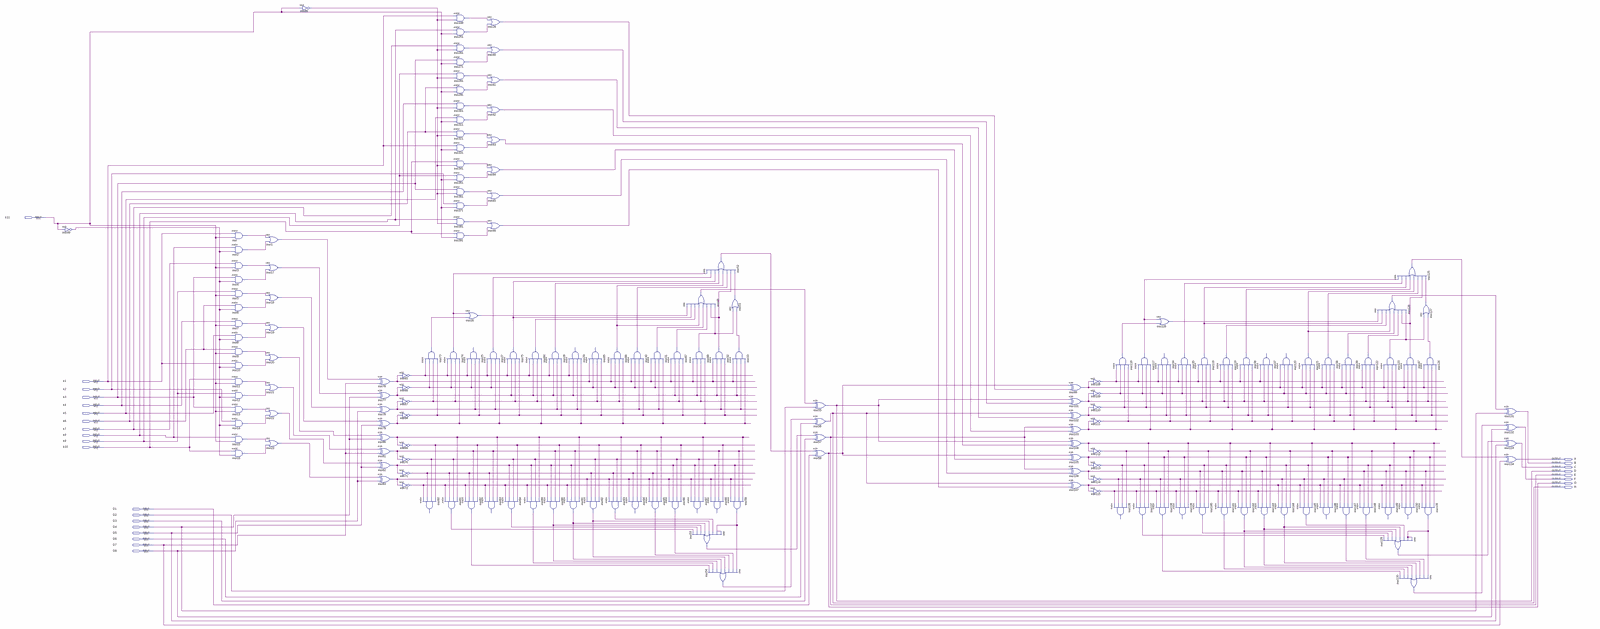
[diagram p0: schematic sheet, whole]
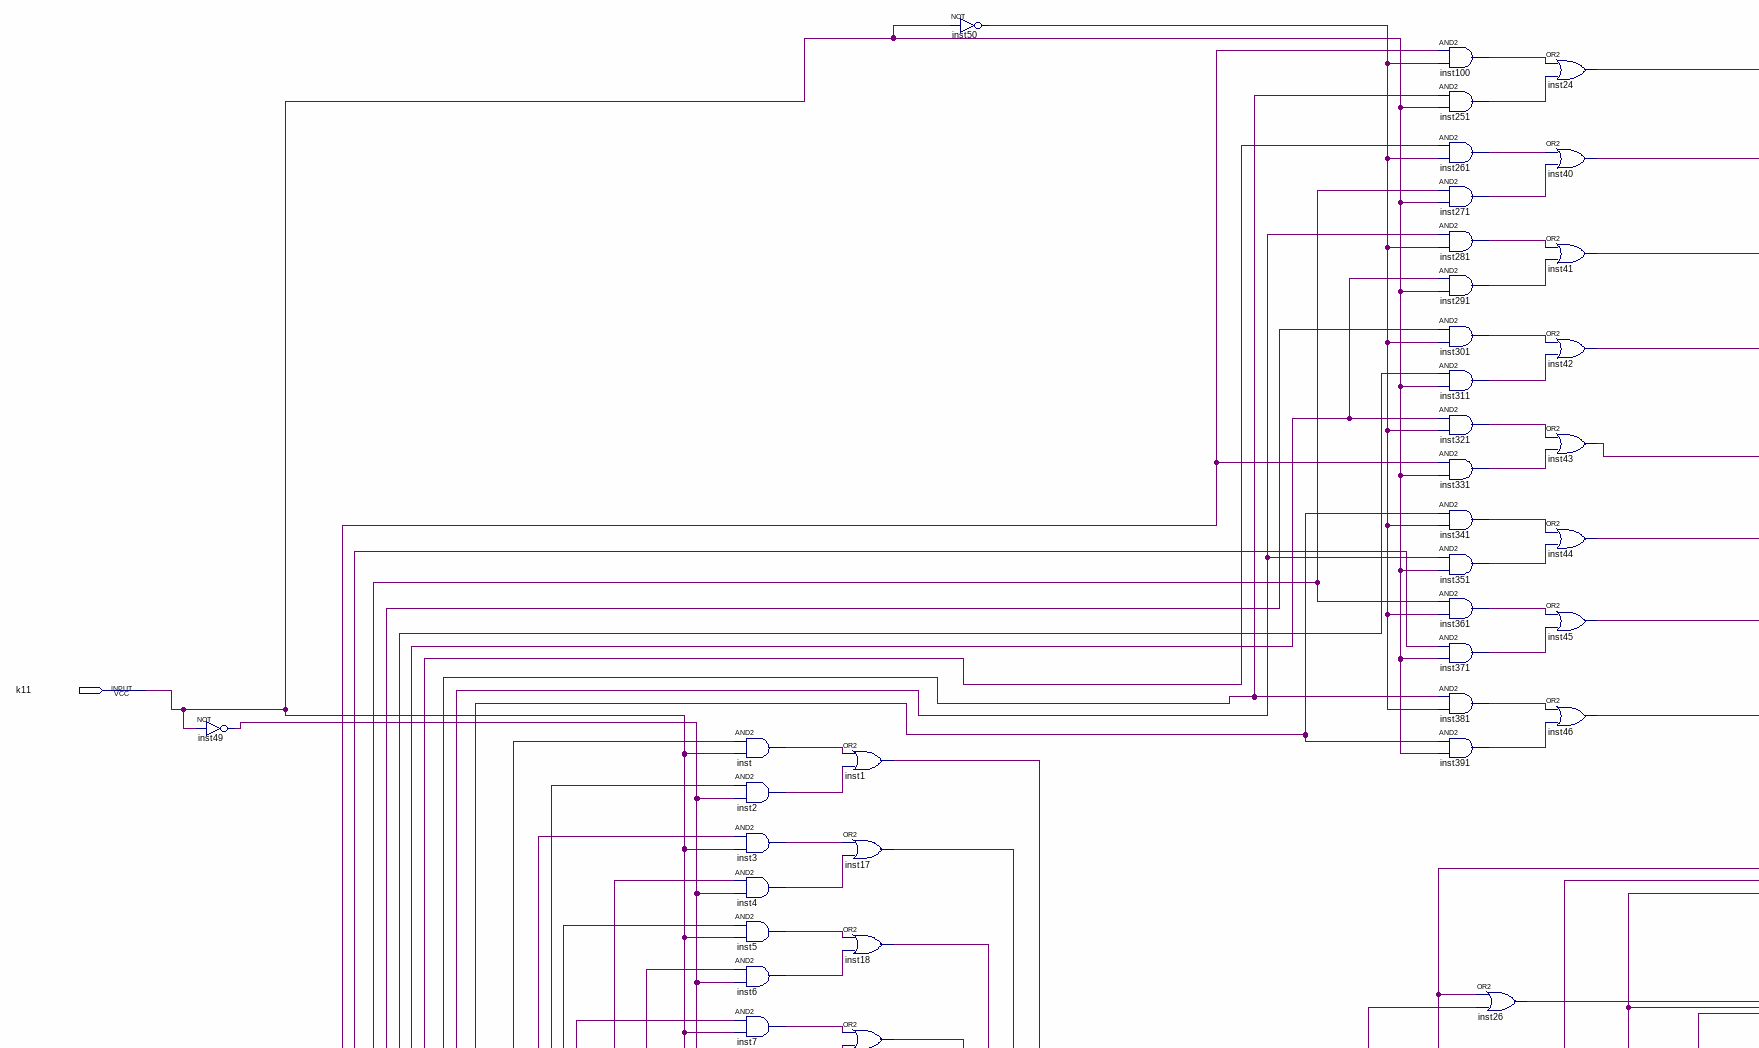
[diagram p1: schematic sheet, upper left part]
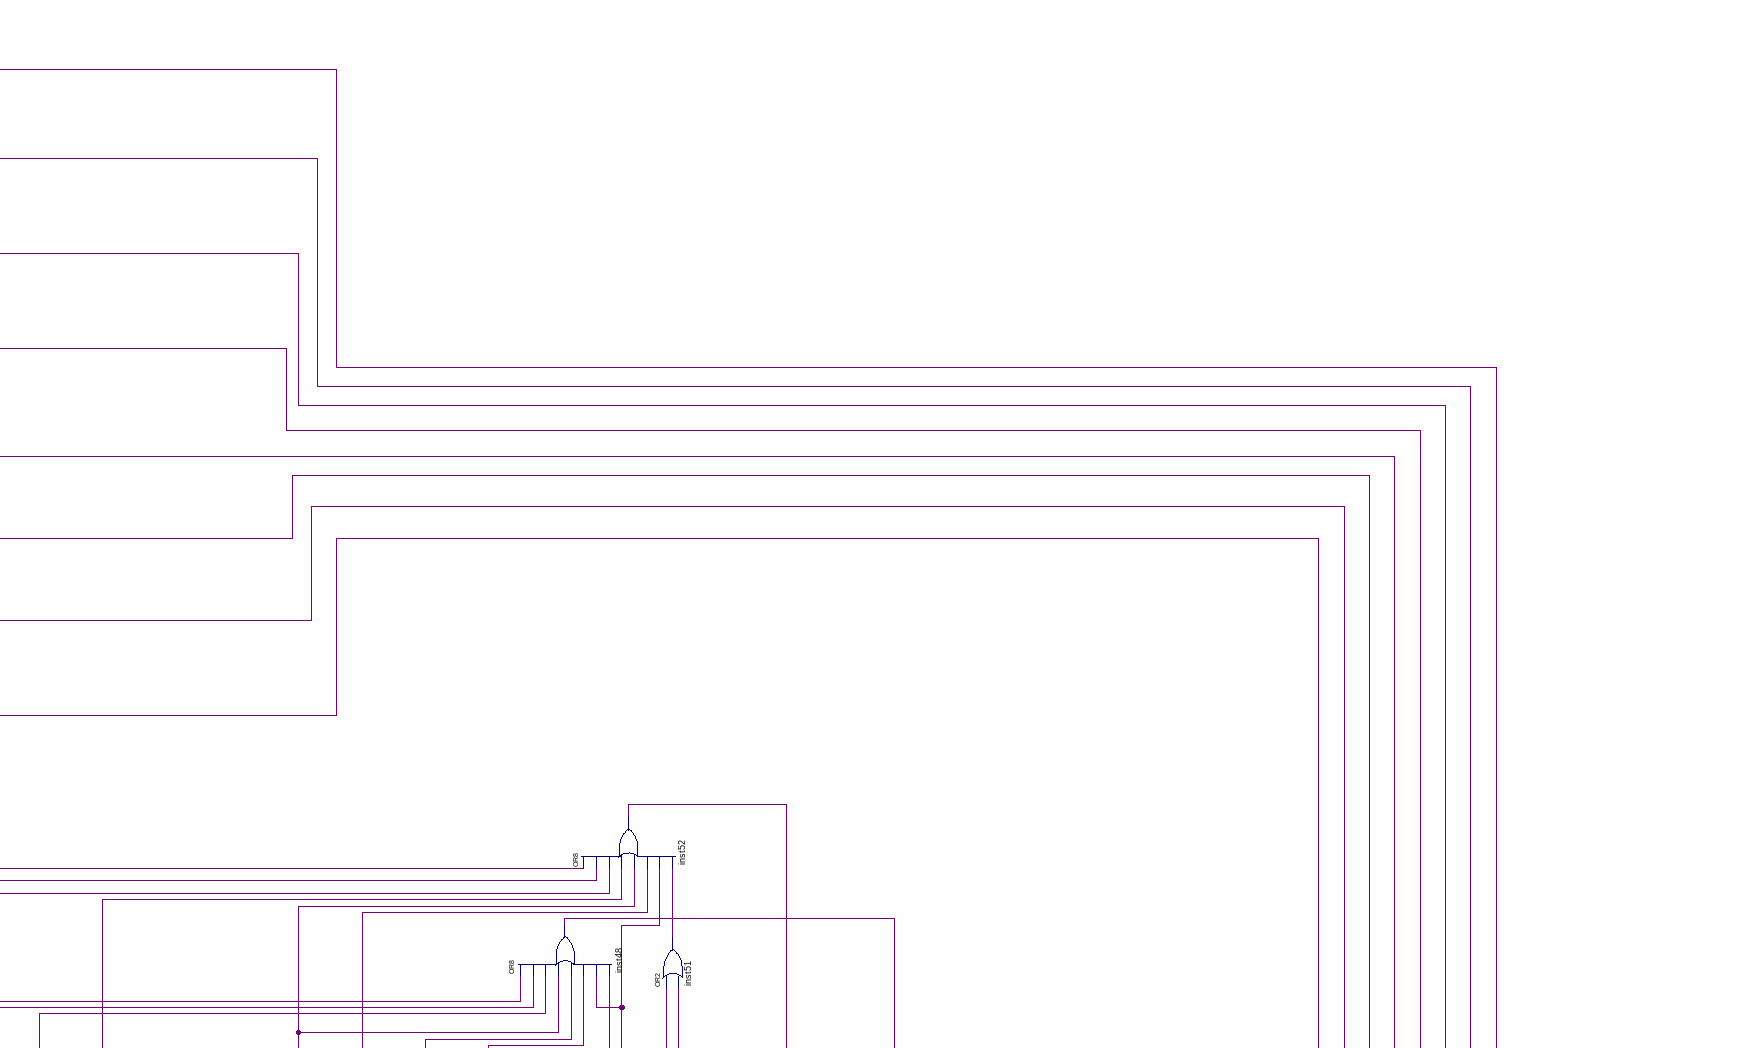
[diagram p2: schematic sheet, upper centre part]
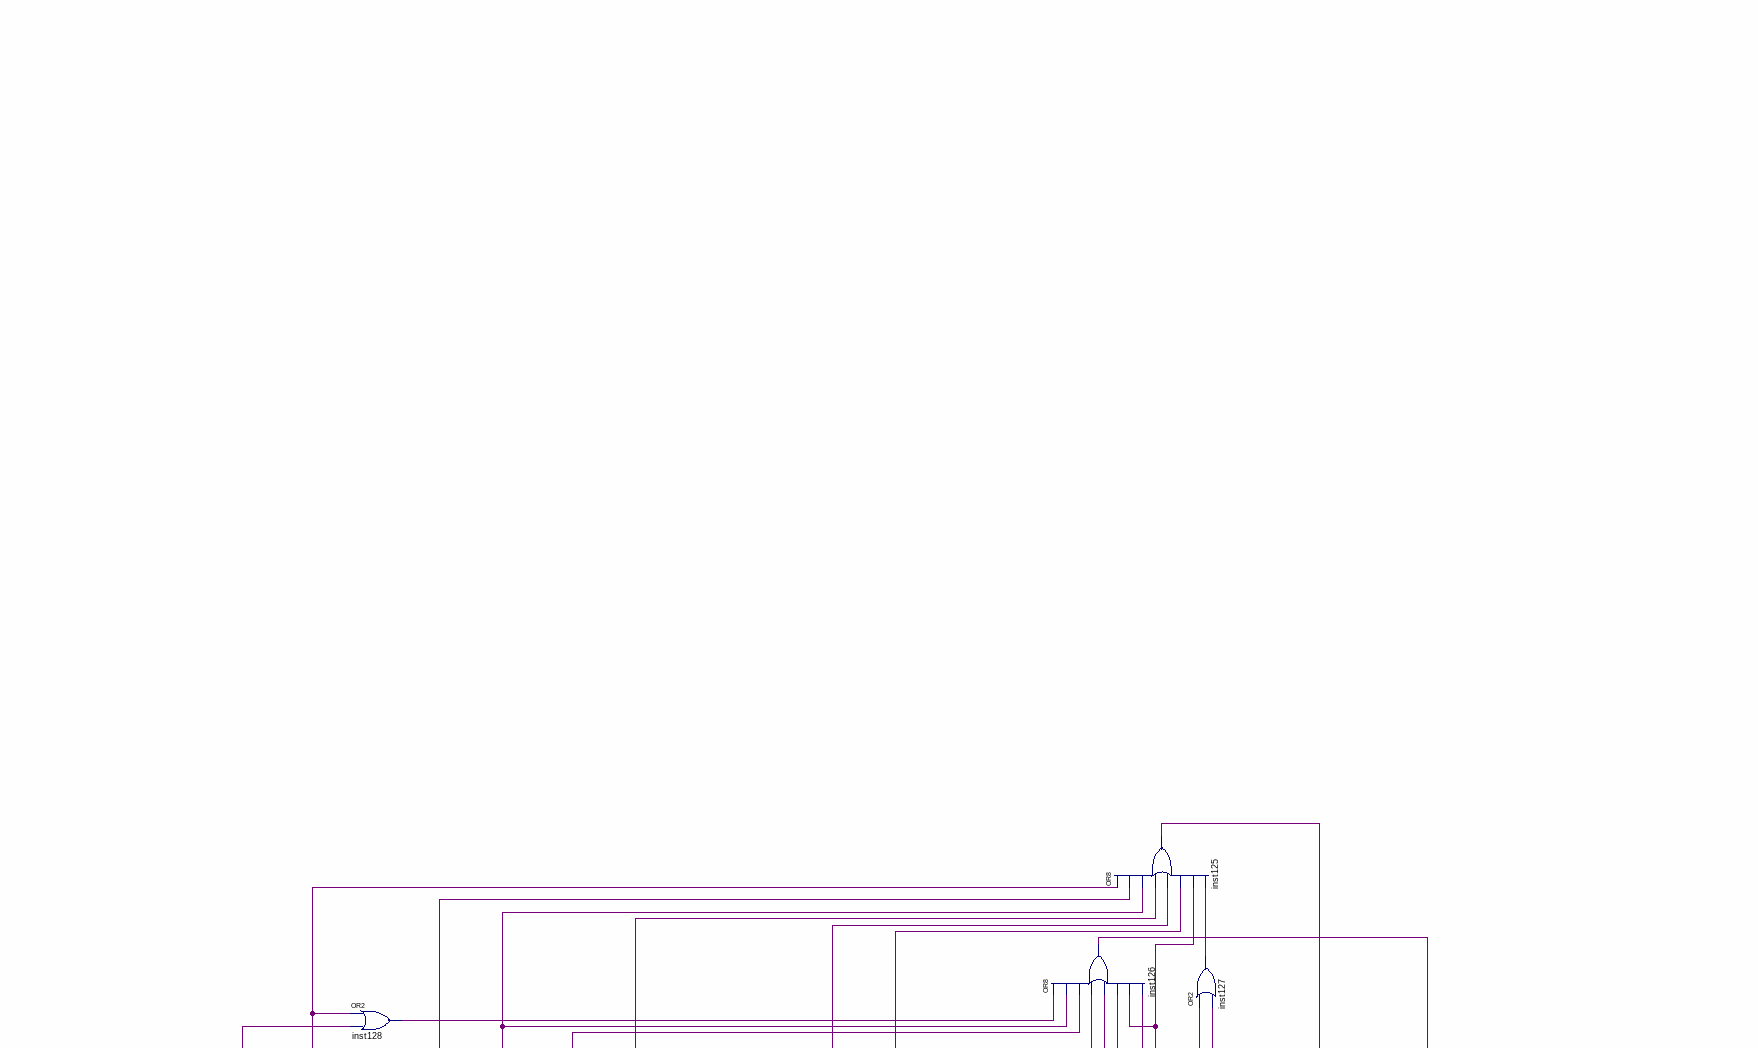
[diagram p3: schematic sheet, upper right part]
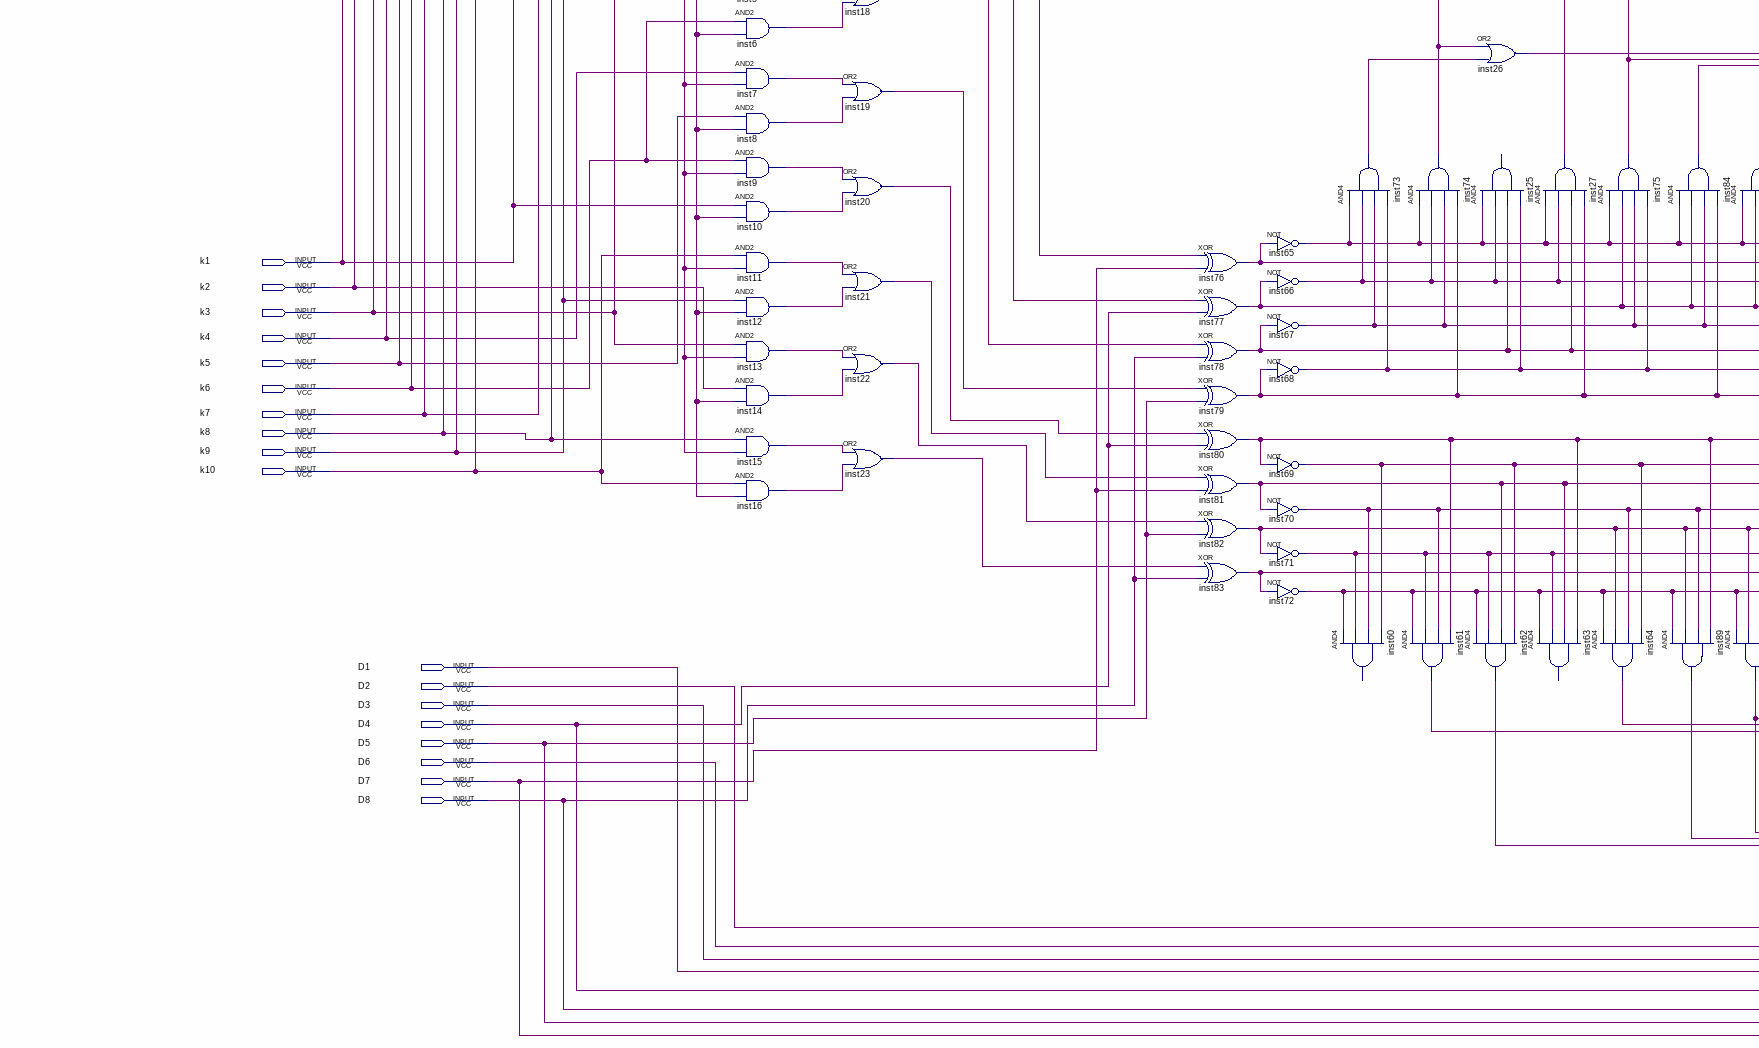
[diagram p4: schematic sheet, lower left part]
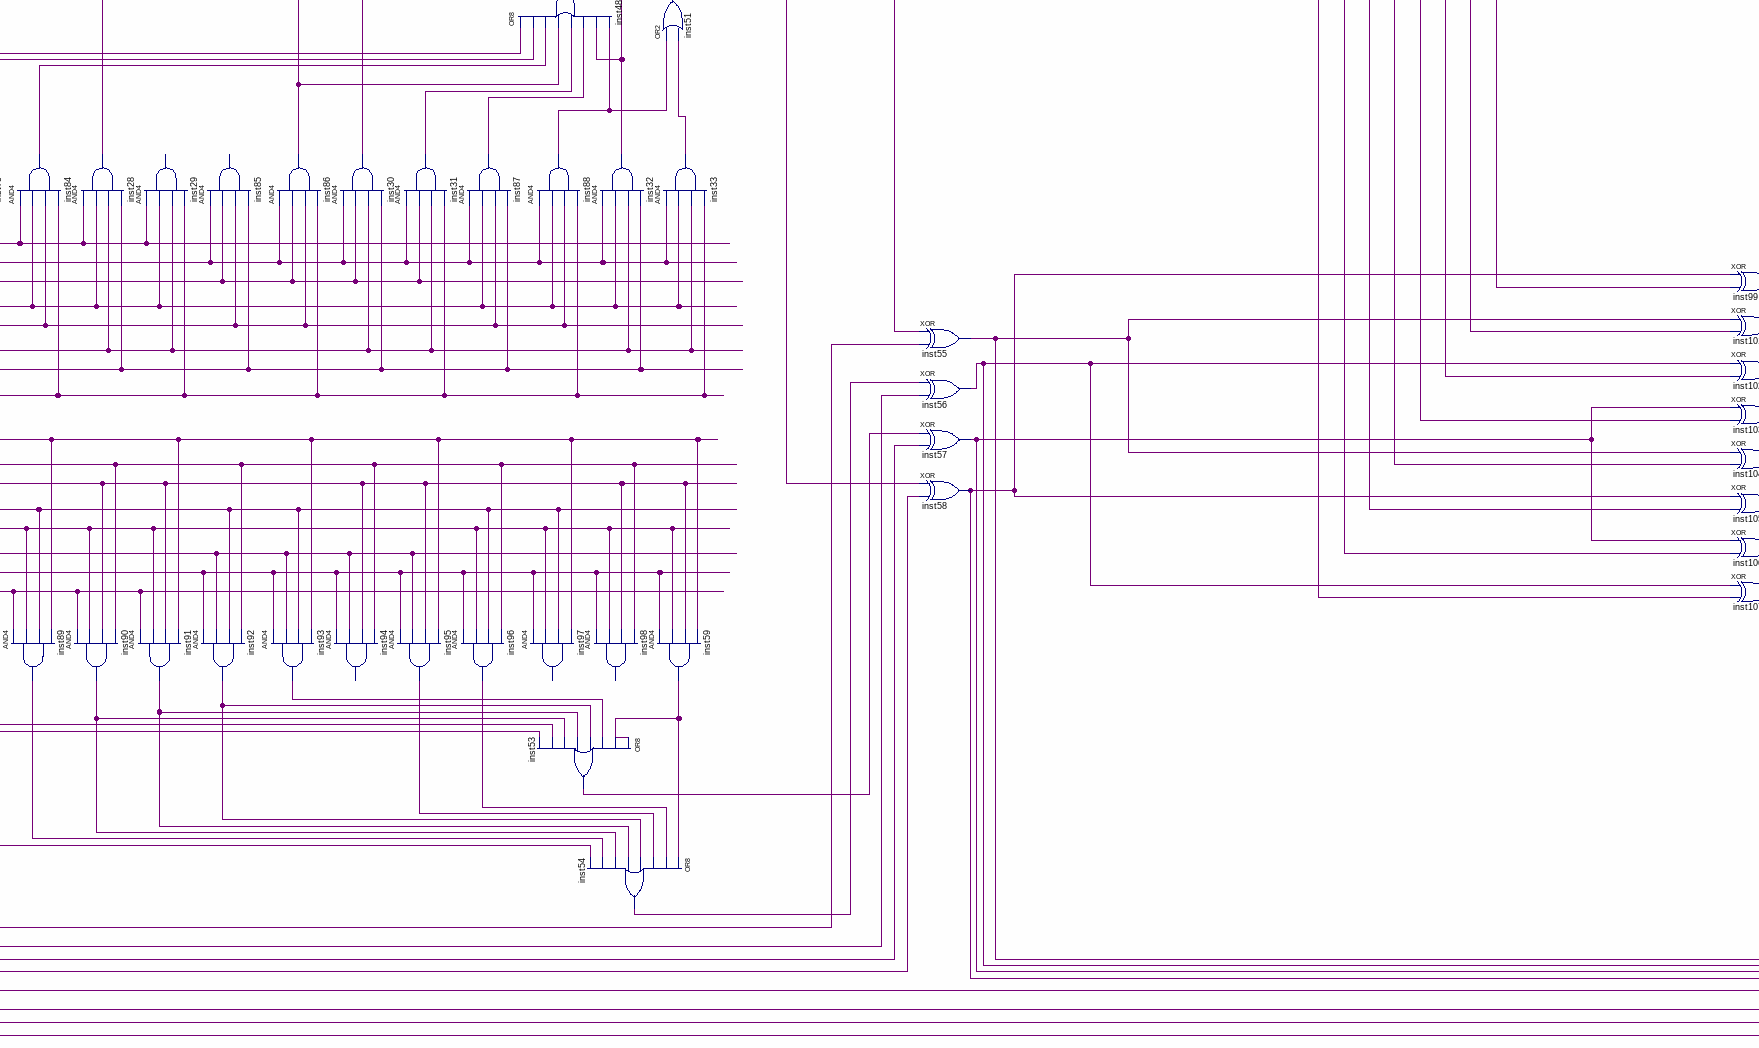
[diagram p5: schematic sheet, lower centre part]
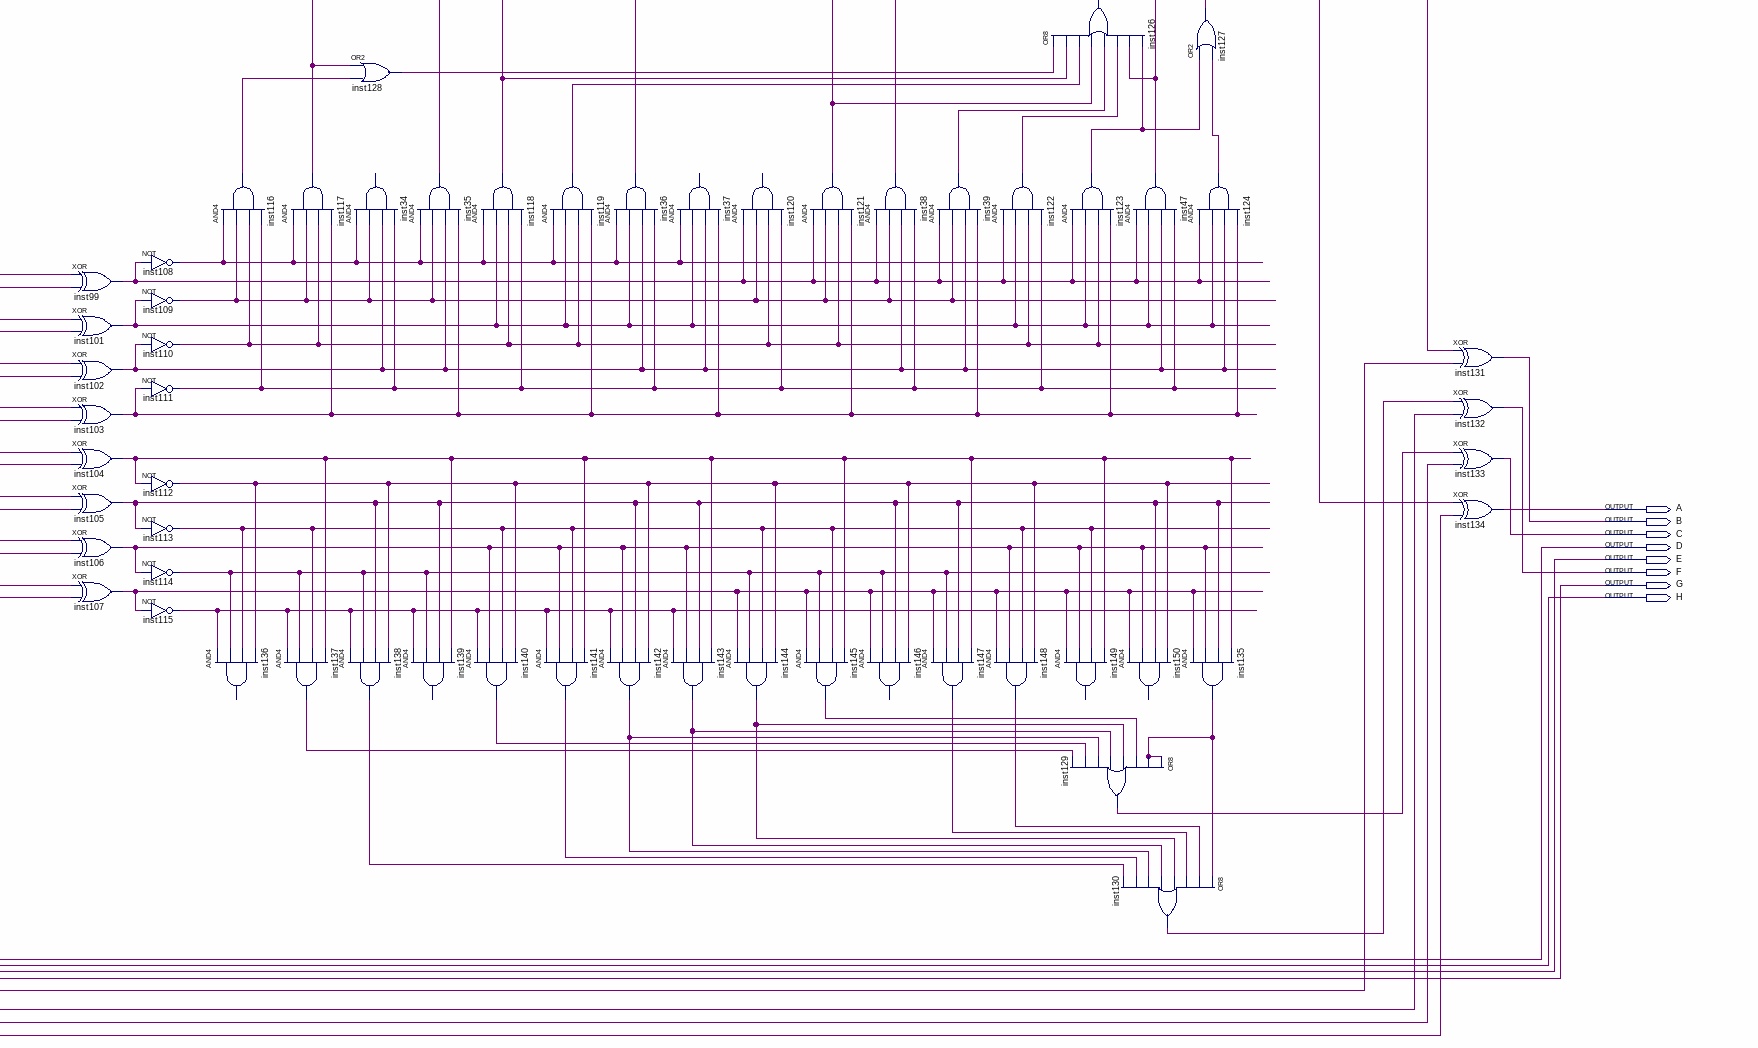
[diagram p6: schematic sheet, lower right part]
// Quartus schematic SDES.bdf as structural Verilog: 166 symbols, 27 pins
module SDES (
  input  k11,
  input  k1,
  input  k2,
  input  k3,
  input  k4,
  input  k5,
  input  k6,
  input  k7,
  input  k8,
  input  k9,
  input  k10,
  input  D1,
  input  D2,
  input  D3,
  input  D4,
  input  D5,
  input  D6,
  input  D7,
  input  D8,
  output A,
  output B,
  output C,
  output D,
  output E,
  output F,
  output G,
  output H
);

  wire inst1_out, inst2_out, inst3_out, inst4_out, inst5_out, inst6_out, inst7_out, inst8_out, inst9_out,
       inst10_out, inst11_out, inst12_out, inst13_out, inst14_out, inst15_out, inst16_out, inst17_out,
       inst18_out, inst19_out, inst20_out, inst21_out, inst22_out, inst23_out, inst24_out, inst26_out,
       inst27_out, inst28_out, inst30_out, inst31_out, inst32_out, inst33_out, inst35_out, inst36_out,
       inst38_out, inst39_out, inst40_out, inst41_out, inst42_out, inst43_out, inst44_out, inst45_out,
       inst46_out, inst47_out, inst48_out, inst49_out, inst50_out, inst51_out, inst52_out, inst53_out,
       inst54_out, inst59_out, inst61_out, inst62_out, inst64_out, inst65_out, inst66_out, inst67_out,
       inst68_out, inst69_out, inst70_out, inst71_out, inst72_out, inst73_out, inst74_out, inst75_out,
       inst76_out, inst77_out, inst78_out, inst79_out, inst80_out, inst81_out, inst82_out, inst83_out,
       inst84_out, inst86_out, inst87_out, inst88_out, inst89_out, inst90_out, inst91_out, inst92_out,
       inst93_out, inst95_out, inst96_out, inst99_out, inst100_out, inst101_out, inst102_out, inst103_out,
       inst104_out, inst105_out, inst106_out, inst107_out, inst108_out, inst109_out, inst110_out,
       inst111_out, inst112_out, inst113_out, inst114_out, inst115_out, inst116_out, inst117_out,
       inst118_out, inst119_out, inst121_out, inst122_out, inst123_out, inst124_out, inst125_out,
       inst126_out, inst127_out, inst128_out, inst129_out, inst130_out, inst135_out, inst137_out,
       inst138_out, inst140_out, inst141_out, inst142_out, inst143_out, inst144_out, inst145_out,
       inst147_out, inst148_out, inst251_out, inst261_out, inst271_out, inst281_out, inst291_out,
       inst301_out, inst311_out, inst321_out, inst331_out, inst341_out, inst351_out, inst361_out,
       inst371_out, inst381_out, inst391_out, inst_out;

  not inst49 (inst49_out, k11);
  and inst (inst_out, k1, k11);
  and inst2 (inst2_out, k8, inst49_out);
  and inst3 (inst3_out, k7, k11);
  and inst4 (inst4_out, k3, inst49_out);
  and inst5 (inst5_out, k9, k11);
  and inst6 (inst6_out, k6, inst49_out);
  and inst7 (inst7_out, k4, k11);
  and inst8 (inst8_out, k5, inst49_out);
  and inst9 (inst9_out, k6, k11);
  and inst10 (inst10_out, k1, inst49_out);
  and inst11 (inst11_out, k10, k11);
  and inst12 (inst12_out, k9, inst49_out);
  and inst13 (inst13_out, k3, k11);
  and inst14 (inst14_out, k2, inst49_out);
  and inst15 (inst15_out, k8, k11);
  and inst16 (inst16_out, k10, inst49_out);
  or inst1 (inst1_out, inst_out, inst2_out);
  or inst17 (inst17_out, inst3_out, inst4_out);
  or inst18 (inst18_out, inst5_out, inst6_out);
  or inst19 (inst19_out, inst7_out, inst8_out);
  or inst20 (inst20_out, inst9_out, inst10_out);
  or inst21 (inst21_out, inst11_out, inst12_out);
  or inst22 (inst22_out, inst13_out, inst14_out);
  or inst23 (inst23_out, inst15_out, inst16_out);
  not inst50 (inst50_out, k11);
  xor inst76 (inst76_out, inst1_out, D7);
  xor inst77 (inst77_out, inst17_out, D4);
  xor inst78 (inst78_out, inst18_out, D8);
  xor inst79 (inst79_out, inst19_out, D5);
  xor inst80 (inst80_out, inst20_out, D4);
  xor inst81 (inst81_out, inst21_out, D7);
  xor inst82 (inst82_out, inst22_out, D5);
  xor inst83 (inst83_out, inst23_out, D8);
  not inst65 (inst65_out, inst76_out);
  not inst66 (inst66_out, inst77_out);
  not inst67 (inst67_out, inst78_out);
  not inst68 (inst68_out, inst79_out);
  not inst69 (inst69_out, inst80_out);
  not inst70 (inst70_out, inst81_out);
  not inst71 (inst71_out, inst82_out);
  not inst72 (inst72_out, inst83_out);
  // AND4 inst60 has open pins: IN1=inst72_out, IN2=inst71_out, IN3=inst70_out, IN4=inst69_out, OUT=open
  and inst73 (inst73_out, inst65_out, inst66_out, inst67_out, inst68_out);
  and inst74 (inst74_out, inst65_out, inst66_out, inst67_out, inst79_out);
  and inst61 (inst61_out, inst72_out, inst71_out, inst70_out, inst80_out);
  and inst100 (inst100_out, k1, inst50_out);
  and inst251 (inst251_out, k8, k11);
  and inst261 (inst261_out, k7, inst50_out);
  and inst271 (inst271_out, k3, k11);
  and inst281 (inst281_out, k9, inst50_out);
  and inst291 (inst291_out, k6, k11);
  and inst301 (inst301_out, k4, inst50_out);
  and inst311 (inst311_out, k5, k11);
  and inst321 (inst321_out, k6, inst50_out);
  and inst331 (inst331_out, k1, k11);
  and inst341 (inst341_out, k10, inst50_out);
  and inst351 (inst351_out, k9, k11);
  and inst361 (inst361_out, k3, inst50_out);
  and inst371 (inst371_out, k2, k11);
  and inst381 (inst381_out, k8, inst50_out);
  and inst391 (inst391_out, k10, k11);
  or inst26 (inst26_out, inst74_out, inst73_out);
  // AND4 inst25 has open pins: IN1=inst65_out, IN2=inst66_out, IN3=inst78_out, IN4=inst68_out, OUT=open
  and inst62 (inst62_out, inst72_out, inst71_out, inst81_out, inst69_out);
  and inst27 (inst27_out, inst65_out, inst66_out, inst78_out, inst79_out);
  // AND4 inst63 has open pins: IN1=inst72_out, IN2=inst71_out, IN3=inst81_out, IN4=inst80_out, OUT=open
  or inst24 (inst24_out, inst100_out, inst251_out);
  or inst40 (inst40_out, inst261_out, inst271_out);
  or inst41 (inst41_out, inst281_out, inst291_out);
  or inst42 (inst42_out, inst301_out, inst311_out);
  or inst43 (inst43_out, inst321_out, inst331_out);
  or inst44 (inst44_out, inst341_out, inst351_out);
  or inst45 (inst45_out, inst361_out, inst371_out);
  or inst46 (inst46_out, inst381_out, inst391_out);
  and inst75 (inst75_out, inst65_out, inst77_out, inst67_out, inst68_out);
  and inst64 (inst64_out, inst72_out, inst82_out, inst70_out, inst69_out);
  and inst84 (inst84_out, inst65_out, inst77_out, inst67_out, inst79_out);
  and inst89 (inst89_out, inst72_out, inst82_out, inst70_out, inst80_out);
  and inst28 (inst28_out, inst65_out, inst77_out, inst78_out, inst68_out);
  and inst90 (inst90_out, inst72_out, inst82_out, inst81_out, inst69_out);
  and inst91 (inst91_out, inst72_out, inst82_out, inst81_out, inst80_out);
  // AND4 inst29 has open pins: IN1=inst65_out, IN2=inst77_out, IN3=inst78_out, IN4=inst79_out, OUT=open
  // AND4 inst85 has open pins: IN1=inst76_out, IN2=inst66_out, IN3=inst67_out, IN4=inst68_out, OUT=open
  and inst92 (inst92_out, inst83_out, inst71_out, inst70_out, inst69_out);
  and inst86 (inst86_out, inst76_out, inst66_out, inst67_out, inst79_out);
  and inst93 (inst93_out, inst83_out, inst71_out, inst70_out, inst80_out);
  and inst30 (inst30_out, inst76_out, inst66_out, inst78_out, inst68_out);
  // AND4 inst94 has open pins: IN1=inst83_out, IN2=inst71_out, IN3=inst81_out, IN4=inst69_out, OUT=open
  and inst31 (inst31_out, inst76_out, inst66_out, inst78_out, inst79_out);
  and inst95 (inst95_out, inst83_out, inst71_out, inst81_out, inst80_out);
  and inst87 (inst87_out, inst76_out, inst77_out, inst67_out, inst68_out);
  and inst96 (inst96_out, inst83_out, inst82_out, inst70_out, inst69_out);
  or inst48 (inst48_out, inst26_out, inst75_out, inst84_out, inst86_out, inst31_out, inst87_out, inst32_out, inst88_out);
  and inst88 (inst88_out, inst76_out, inst77_out, inst67_out, inst79_out);
  // AND4 inst97 has open pins: IN1=inst83_out, IN2=inst82_out, IN3=inst70_out, IN4=inst80_out, OUT=open
  or inst53 (inst53_out, inst59_out, inst59_out, inst93_out, inst92_out, inst91_out, inst90_out, inst64_out, inst61_out);
  or inst52 (inst52_out, inst74_out, inst27_out, inst75_out, inst28_out, inst86_out, inst30_out, inst32_out, inst51_out);
  // AND4 inst98 has open pins: IN1=inst83_out, IN2=inst82_out, IN3=inst81_out, IN4=inst69_out, OUT=open
  or inst54 (inst54_out, inst59_out, inst96_out, inst95_out, inst92_out, inst91_out, inst90_out, inst89_out, inst62_out);
  and inst32 (inst32_out, inst76_out, inst77_out, inst78_out, inst68_out);
  or inst51 (inst51_out, inst88_out, inst33_out);
  and inst33 (inst33_out, inst76_out, inst77_out, inst78_out, inst79_out);
  and inst59 (inst59_out, inst83_out, inst82_out, inst81_out, inst80_out);
  xor inst55 (D, inst48_out, D2);
  xor inst56 (H, inst54_out, D6);
  xor inst57 (E, inst53_out, D3);
  xor inst58 (G, inst52_out, D1);
  xor inst99 (inst99_out, G, inst24_out);
  xor inst101 (inst101_out, D, inst40_out);
  xor inst102 (inst102_out, H, inst41_out);
  xor inst103 (inst103_out, E, inst42_out);
  xor inst104 (inst104_out, D, inst43_out);
  xor inst105 (inst105_out, G, inst44_out);
  xor inst106 (inst106_out, E, inst45_out);
  xor inst107 (inst107_out, H, inst46_out);
  not inst108 (inst108_out, inst99_out);
  not inst109 (inst109_out, inst101_out);
  not inst110 (inst110_out, inst102_out);
  not inst111 (inst111_out, inst103_out);
  not inst112 (inst112_out, inst104_out);
  not inst113 (inst113_out, inst105_out);
  not inst114 (inst114_out, inst106_out);
  not inst115 (inst115_out, inst107_out);
  and inst116 (inst116_out, inst108_out, inst109_out, inst110_out, inst111_out);
  // AND4 inst136 has open pins: IN1=inst115_out, IN2=inst114_out, IN3=inst113_out, IN4=inst112_out, OUT=open
  and inst117 (inst117_out, inst108_out, inst109_out, inst110_out, inst103_out);
  and inst137 (inst137_out, inst115_out, inst114_out, inst113_out, inst104_out);
  // AND4 inst34 has open pins: IN1=inst108_out, IN2=inst109_out, IN3=inst102_out, IN4=inst111_out, OUT=open
  and inst138 (inst138_out, inst115_out, inst114_out, inst105_out, inst112_out);
  or inst128 (inst128_out, inst117_out, inst116_out);
  and inst35 (inst35_out, inst108_out, inst109_out, inst102_out, inst103_out);
  // AND4 inst139 has open pins: IN1=inst115_out, IN2=inst114_out, IN3=inst105_out, IN4=inst104_out, OUT=open
  and inst118 (inst118_out, inst108_out, inst101_out, inst110_out, inst111_out);
  and inst140 (inst140_out, inst115_out, inst106_out, inst113_out, inst112_out);
  and inst119 (inst119_out, inst108_out, inst101_out, inst110_out, inst103_out);
  and inst141 (inst141_out, inst115_out, inst106_out, inst113_out, inst104_out);
  and inst142 (inst142_out, inst115_out, inst106_out, inst105_out, inst112_out);
  and inst36 (inst36_out, inst108_out, inst101_out, inst102_out, inst111_out);
  // AND4 inst37 has open pins: IN1=inst108_out, IN2=inst101_out, IN3=inst102_out, IN4=inst103_out, OUT=open
  and inst143 (inst143_out, inst115_out, inst106_out, inst105_out, inst104_out);
  // AND4 inst120 has open pins: IN1=inst99_out, IN2=inst109_out, IN3=inst110_out, IN4=inst111_out, OUT=open
  and inst144 (inst144_out, inst107_out, inst114_out, inst113_out, inst112_out);
  and inst121 (inst121_out, inst99_out, inst109_out, inst110_out, inst103_out);
  and inst145 (inst145_out, inst107_out, inst114_out, inst113_out, inst104_out);
  and inst38 (inst38_out, inst99_out, inst109_out, inst102_out, inst111_out);
  // AND4 inst146 has open pins: IN1=inst107_out, IN2=inst114_out, IN3=inst105_out, IN4=inst112_out, OUT=open
  and inst39 (inst39_out, inst99_out, inst109_out, inst102_out, inst103_out);
  and inst147 (inst147_out, inst107_out, inst114_out, inst105_out, inst104_out);
  and inst122 (inst122_out, inst99_out, inst101_out, inst110_out, inst111_out);
  and inst148 (inst148_out, inst107_out, inst106_out, inst113_out, inst112_out);
  or inst126 (inst126_out, inst128_out, inst118_out, inst119_out, inst121_out, inst39_out, inst122_out, inst47_out, inst123_out);
  // AND4 inst149 has open pins: IN1=inst107_out, IN2=inst106_out, IN3=inst113_out, IN4=inst104_out, OUT=open
  or inst125 (inst125_out, inst117_out, inst35_out, inst118_out, inst36_out, inst121_out, inst38_out, inst47_out, inst127_out);
  and inst123 (inst123_out, inst99_out, inst101_out, inst110_out, inst103_out);
  or inst129 (inst129_out, inst135_out, inst135_out, inst145_out, inst144_out, inst143_out, inst142_out, inst140_out, inst137_out);
  and inst47 (inst47_out, inst99_out, inst101_out, inst102_out, inst111_out);
  // AND4 inst150 has open pins: IN1=inst107_out, IN2=inst106_out, IN3=inst105_out, IN4=inst112_out, OUT=open
  or inst130 (inst130_out, inst135_out, inst148_out, inst147_out, inst144_out, inst143_out, inst142_out, inst141_out, inst138_out);
  or inst127 (inst127_out, inst123_out, inst124_out);
  and inst124 (inst124_out, inst99_out, inst101_out, inst102_out, inst103_out);
  and inst135 (inst135_out, inst107_out, inst106_out, inst105_out, inst104_out);
  xor inst131 (B, inst126_out, D4);
  xor inst132 (F, inst130_out, D8);
  xor inst133 (C, inst129_out, D5);
  xor inst134 (A, inst125_out, D7);
endmodule
